# EAGLE design tiny-bridge (EAGLE 5.07)
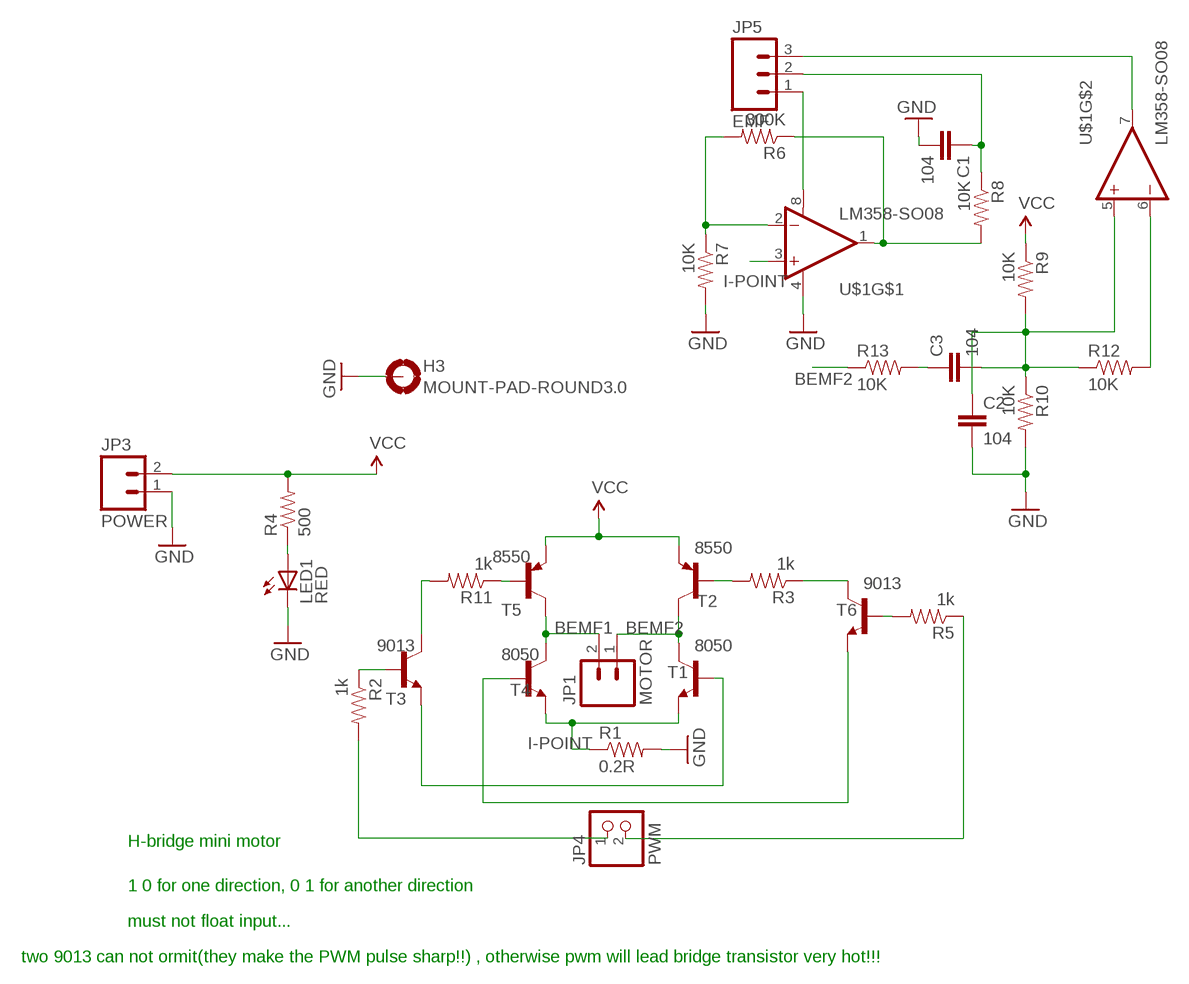
[diagram p0: schematic, sheet 1]

## Parts
C1  104  CAP-C0805  [C0805]
C2  104  CAP-C0805  [C0805]
C3  104  CAP-C0805  [C0805]
H3  MOUNT-PAD-ROUND3.0  [3,0-PAD]
JP1  MOTOR  CON-02-XH  [XH-1X2-LONG-LOCK]
JP3  POWER  CON-02-XH  [XH-1X2-LONG-LOCK]
JP4  PWM  PINHD-1X2/90  [1X02/90]
JP5  EMF  M03PTH  [1X03]
LED1  RED  LED0805  [CHIPLED_0805]
R1  0.2R  RESISTOR-R2512  [R2512]
R2  1k  RESISTOR0805  [0805]
R3  1k  RESISTOR0805  [0805]
R4  500  RESISTOR0805  [0805]
R5  1k  RESISTOR0805  [0805]
R6  300K  RESISTOR0805  [0805]
R7  10K  RESISTOR0805  [0805]
R8  10K  RESISTOR0805  [0805]
R9  10K  RESISTOR0805  [0805]
R10  10K  RESISTOR0805  [0805]
R11  1k  RESISTOR0805  [0805]
R12  10K  RESISTOR0805  [0805]
R13  10K  RESISTOR0805  [0805]
T1  8050  90**-NPN-SOT23-BEC  [SOT23-BEC]
T2  8550  90**-PNP-SOT23-BEC  [SOT23-BEC]
T3  9013  90**-NPN-SOT23-BEC  [SOT23-BEC]
T4  8050  90**-NPN-SOT23-BEC  [SOT23-BEC]
T5  8550  90**-PNP-SOT23-BEC  [SOT23-BEC]
T6  9013  90**-NPN-SOT23-BEC  [SOT23-BEC]
U$1  LM358-SO08  [SO08]

## Nets
BEMF1: JP1.2 T4.C T5.C
BEMF2: JP1.1 R13.1 T1.C T2.C
GND: C1.2 C2.2 H3.B3,0(MOUNT) JP3.1 LED1.C R1.2 R7.2 R10.2 U$1.4(V-)
I-POINT: R1.1 T1.E T4.E U$1.3(+IN)
N$1: LED1.A R4.1
N$2: R11.1 T5.B
N$3: JP5.1 U$1.8(V+)
N$5: T4.B T6.E
N$6: R3.2 T2.B
N$8: T1.B T3.E
N$9: R11.2 T3.C
N$10: JP4.2 R5.1
N$11: R5.2 T6.B
N$12: R3.1 T6.C
N$13: JP4.1 R2.2
N$14: R2.1 T3.B
N$15: C1.1 JP5.2 R8.1
N$16: R6.1 R8.2 U$1.1(OUT)
N$17: R6.2 R7.1 U$1.2(-IN)
N$19: C2.1 C3.2 R9.2 R10.1 R12.1 U$1.5(+IN)
N$20: R12.2 U$1.6(-IN)
N$22: JP5.3 U$1.7(OUT)
N$23: C3.1 R13.2
VCC: JP3.2 R4.2 R9.1 T2.E T5.E

## Notes on the sheet
- H-bridge mini motor
- 1 0 for one direction, 0 1 for another direction
- must not float input...
- two 9013 can not ormit(they make the PWM pulse sharp!!) , otherwise pwm will lead bridge transistor very hot!!!

## Library data of the parts
C1-C3 = digital-toy:CAP: Capacitor Standard 0603 ceramic capacitor, and 0.1" leaded capacitor.
H3 = holes:MOUNT-PAD-ROUND: MOUNTING PAD, round
JP1 JP3 = digital-toy:CON-02: Header 2 Standard 2-pin 0.1" header. Use with straight break away headers (SKU : PRT-00116), right angle break away headers (PRT-00553), swiss pins (PRT-00743), machine pins (PRT-00117), and female headers (PRT-00115). Molex polarized connector foot print use with SKU : PRT-08233 with associated crimp pins and housings.
JP4 = pinhead:PINHD-1X2: PIN HEADER
JP5 = SparkFun:M03: Header 3 Standard 3-pin 0.1" header. Use with straight break away headers (SKU : PRT-00116), right angle break away headers (PRT-00553), swiss pins (PRT-00743), machine pins (PRT-00117), and female headers (PRT-00115). Molex polarized connector foot print use with SKU : PRT-08232 with associated crimp pins and housings.
LED1 = digital-toy:LED: LEDs Standard schematic elements and footprints for 5mm, 3mm, 1206, and 0603 sized LEDs. 5mm - Spark Fun Electronics SKU : COM-00529 (and others) copy led.lbr 0805 led here, by hyl digital-toy. 2010.6.29
R1-R13 = digital-toy:RESISTOR: Resistor Basic schematic elements and footprints for 0603, 1206, and PTH 1/10th watt (small) resistors. digital-toy copy vertical mount of axial-0.3 from rcl.lbr : the 0207/xx
T1 T3 T4 T6 = digital-toy:*-NPN-: NPN Transistror most of sot-23 use the pacages sot23-BEC, top C, left B, right E. by hyl, digital-toy. and to-92 use ebc(from-top) by hyl, digital-toy.
T2 T5 = digital-toy:*-PNP-: PNP Transistror
U$1 = digital-toy:LM358

## Board
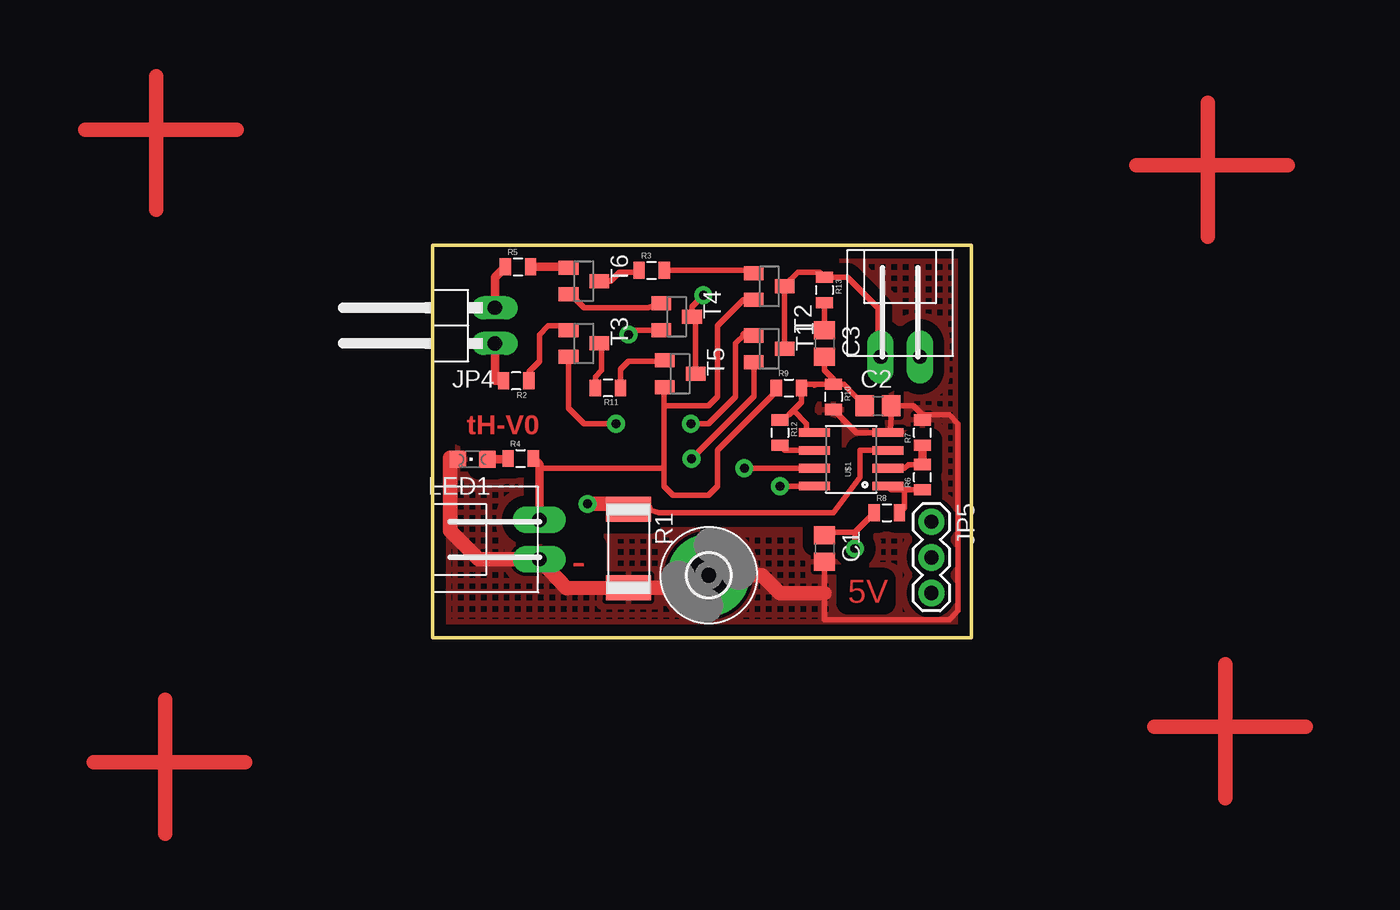
[diagram p1: board, top side]
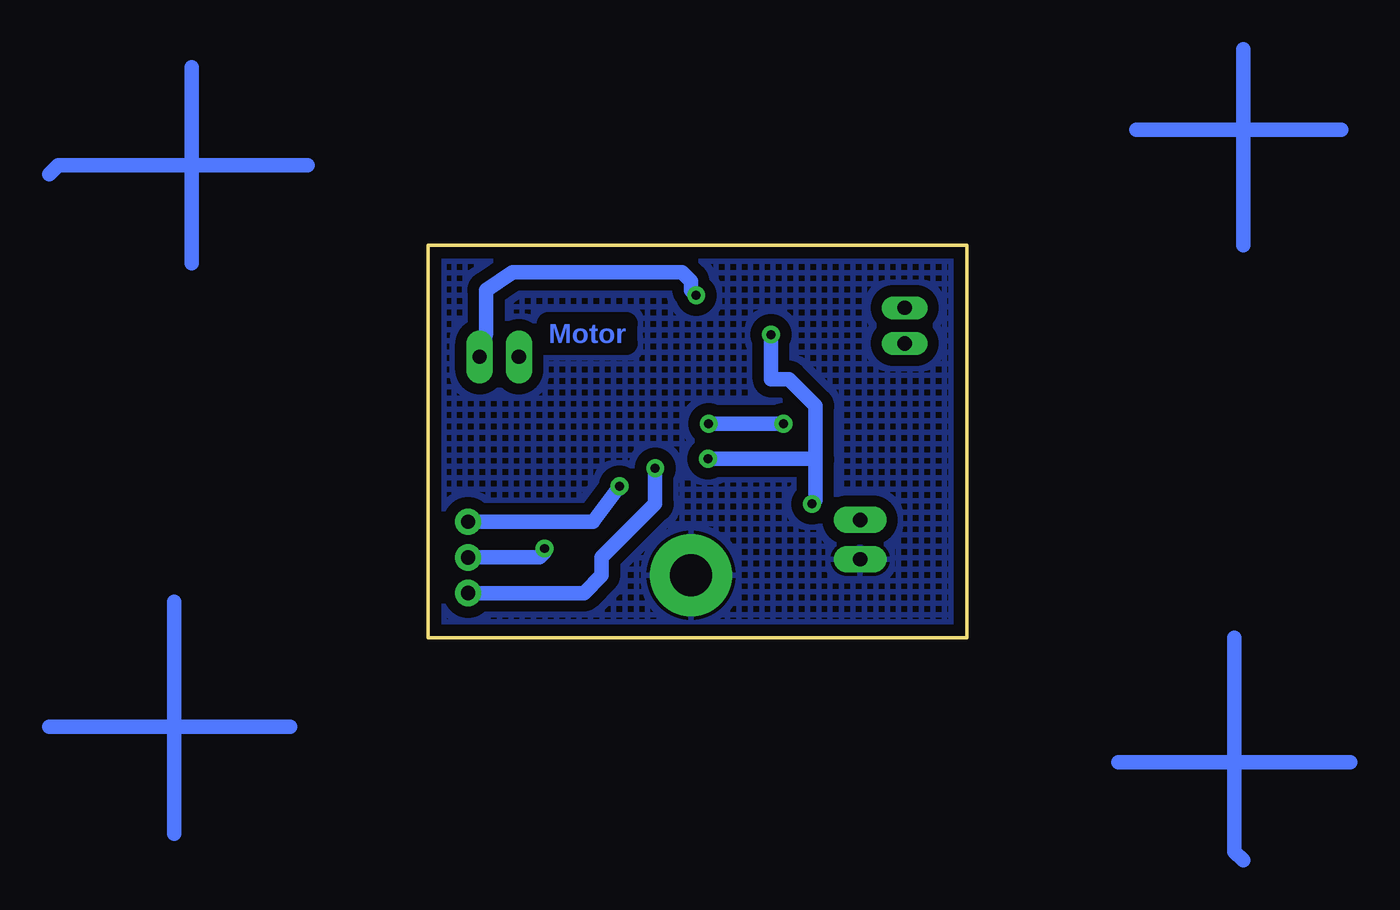
[diagram p2: board, bottom side, seen from below]

Size 38.42 x 27.94 mm. Coordinates in mm from the lower left corner, seen from the top.
Outline: 0,0 38.42,0 38.42,27.94 0,27.94 0,0
Copper layers (1*16): Top 0.035mm / dielectric 1.5mm / Bottom 0.035mm
Design rules "SparkFun-HP1007-600x600dpi": minimum track width 10mil, minimum drill 20mil, track to track 12mil, track to pad 12mil, pad to pad 12mil, via to via 12mil, smd to smd 12mil, copper to edge 12mil, drill to drill 12mil, minimum pad ring 12mil, minimum via ring 10mil, stop-mask expansion 4mil, vias tented up to drill 25mil, thermal gap 10mil

### Footprints (pad centres in the part's own frame; a part is rotated, then mirrored left to right if it is on the bottom)
C0805 = smd 1.3 x 1.5: 1 -0.95,0; 2 0.95,0
3,0-PAD = drill 3 pad 5.842 round: B3,0 0,0
XH-1X2-LONG-LOCK = drill 1.016 pad 1.88 long: 1 -1.397,0; 2 1.397,0
1X02/90 = drill 1.016 long: 1 -1.27,-3.81; 2 1.27,-3.81
1X03 = drill 1.016 pad 1.88 round: 1 0,0; 2 2.54,0; 3 5.08,0
CHIPLED_0805 = smd 1.2 x 1.2: A 0,-1.05; C 0,1.05
R2512 = smd 1.8 x 3.2: 1 -2.8,0; 2 2.8,0
0805 = smd 0.8 x 1.2: 1 -0.9,0; 2 0.9,0
SOT23-BEC = smd 1 x 1.4: B -0.95,-1.1; C 0,1.1; E 0.95,-1.1
SO08 = smd 0.61 x 2.21: 1 -1.905,-2.616; 2 -0.635,-2.616; 3 0.635,-2.616; 4 1.905,-2.616; 5 1.905,2.616; 6 0.635,2.616; 7 -0.635,2.616; 8 -1.905,2.616

### Placement (x,y rotation side)
C1  27.94,6.35 270 top
C2  31.75,16.51 0 top
C3  27.94,20.95 270 top
H3  19.68,4.45 0 top
JP1  33.34,20 0 top
JP3  7.62,6.99 90 top
JP4  0.64,22.23 90 top
JP5  35.56,8.26 270 top
LED1  2.86,12.7 90 top
R1  13.97,6.35 270 top
R2  5.97,18.29 180 top
R3  15.62,26.16 0 top
R4  6.29,12.76 0 top
R5  6.1,26.42 0 top
R6  34.92,11.43 90 top
R7  34.92,14.61 90 top
R8  32.38,8.89 0 top
R9  25.4,17.78 0 top
R10  28.57,17.14 270 top
R11  12.51,17.78 180 top
R12  24.77,14.61 270 top
R13  27.94,24.77 270 top
T1  24,20.57 270 top
T2  24,25.02 270 top
T3  10.79,20.95 270 top
T4  17.4,22.86 270 top
T5  17.65,18.8 270 top
T6  10.79,25.4 270 top
U$1  29.84,12.7 90 top

### Tracks (layer width: path | path; a pad name or v marks a point on that pad's centre or on a via)
BEMF1  (via drill 0.64 pad 1.27)
  Top 0.406: T5.C 18.75,22.56 | T4.C 18.5,23.58 v19.3,24.38
  Top 0.61: 18.75,22.56 18.41,22.86 T4.C
  Bottom 0.254: 19.68,25.27 19.68,25.4
  Bottom 1.016: JP1.2 34.29,21.72 34.29,24.77 32.38,26.04 20.32,26.04 19.68,25.4 | 19.68,25.27 19.68,24.77 v19.3,24.38
BEMF2
  Top 0.406: T1.C T2.C 25.1,25.1 26.04,26.04 27.57,26.04 R13.1 29.58,25.66 31.75,23.5 31.75,20.19 JP1.1
GND
  Top 0.406: C1.2 27.94,3.17 27.94,1.27 36.83,1.27 37.47,1.91 37.47,15.24 36.83,15.88 34.92,15.88 | 34.92,15.88 34.29,16.51 C2.2 32.65,14.61 U$1.4 | U$1.4 33.02,14.61 | U$1.4 30.21,14.61 R10.2 | JP3.1 7.79,5.42 | 34.92,15.88 R7.2
  Top 0.61: 1.27,12.8 LED1.C
  Top 1.016: 1.27,12.8 1.27,7.62 3.3,5.59 JP3.1 | 27.94,3.17 24.77,3.17 23.5,4.45 H3.B3,0 18.79,3.55 R1.2 9.56,3.52 7.79,5.42
  pour Bottom (isolate 0.813, rank 6, hatched): -8.57,34.61 46.67,34.29 46.99,-14.29 -9.21,-10.79
  pour Top (isolate 0.813, hatched): -3.81,31.43 44.45,30.8 43.81,-3.49 43.81,-9.84 -3.17,-9.84 -4.13,-9.53 -4.13,-0.64
I-POINT  (via drill 0.64 pad 1.27)
  Top 0.406: T4.E 14.29,21.91 v13.97,21.59 | T1.E 22.9,17.19 v18.46,12.74 | U$1.3 30.48,13.34 30.48,11.43 28.57,8.89 16.13,8.89 15.2,9.19 | 13.68,9.53 R1.1
  Top 1.016: v11.05,9.53 13.68,9.53 | R1.1 15.2,9.19
  Bottom 0.406: 10.79,12.7 10.84,12.74
  Bottom 1.016: v13.97,21.59 13.97,18.41 12.7,18.41 10.79,16.51 10.79,12.7 10.79,9.78 v11.05,9.53 | 10.84,12.74 v18.46,12.74
N$1
  Top 0.254: 5.32,12.7 R4.1
  Top 0.61: LED1.A 5.32,12.7
N$2
  Top 0.254: 16.49,19.68 T5.B
  Top 0.406: R11.1 13.41,19.12 13.97,19.68 16.49,19.68
N$3  (via drill 0.64 pad 1.27)
  Top 0.406: v24.77,10.79 U$1.8
  Bottom 1.016: JP5.1 26.67,8.26 v24.77,10.79
N$5
  Top 0.254: T6.E 9.84,24.45
  Top 0.406: 9.84,24.45 10.79,23.5 15.35,23.5 T4.B
N$6
  Top 0.254: 22.71,26.16 T2.B
  Top 0.406: R3.2 22.71,26.16
N$7
  Top 1.016: -24.77,36.2 -13.97,36.2
N$8  (via drill 0.64 pad 1.27)
  Top 0.254: 22.84,21.59 T1.B
  Top 0.406: 22.23,21.59 21.59,20.95 21.59,17.14 19.68,15.24 v18.41,15.24 | T3.E 9.7,16.34 10.79,15.24 v13.08,15.24
  Top 0.61: 22.23,21.59 22.84,21.59
  Bottom 1.016: v13.08,15.24 v18.41,15.24
N$9
  Top 0.254: 12.06,20.79 T3.C
  Top 0.406: R11.2 11.61,18.59 12.06,19.05 12.06,20.79
N$10
  Top 0.61: JP4.2 4.45,25.66 R5.1
N$11
  Top 0.254: 9.06,26.42 T6.B
  Top 0.61: R5.2 9.06,26.42
N$12
  Top 0.254: 14.59,26.04 R3.1
  Top 0.406: T6.C 12.7,25.4 13.34,26.04 14.59,26.04
N$13
  Top 0.61: JP4.1 4.45,18.3 R2.2
N$14
  Top 0.406: R2.1 6.87,18.93 7.62,19.68 7.62,21.59 8.26,22.23 9.38,22.23 T3.B
N$15  (via drill 0.64 pad 1.27)
  Top 0.406: 30.11,7.51 R8.1 | 30.11,7.51 v30.11,6.35 | C1.1 28.2,7.51 30.11,7.51
  Bottom 1.016: JP5.2 30.48,5.71 30.11,6.08 v30.11,6.35
N$16
  Top 0.406: 35.19,10.53 R6.1 33.66,10.53 | U$1.1 32.73,10.53 33.66,10.53 | R8.2 33.66,9.26 33.66,10.53
N$17
  Top 0.406: U$1.2 33.66,12.06 33.92,12.33 R6.2
  Top 0.61: R6.2 R7.1
N$18
  Top 1.016: -19.68,30.48 -19.68,40.01
N$19
  Top 0.406: R10.1 29.32,18.05 C2.1 | C3.2 27.94,19.05 28.57,18.41 R10.1 | 27.3,18.05 26.57,18.05 R9.2 26.3,16.77 25.72,16.19 | 27.3,18.05 R10.1 | 25.72,16.19 25.4,15.88 R12.1 | 27.3,18.05 27.23,17.97 | U$1.5 26.67,14.61 26.67,15.24 25.72,16.19
N$20
  Top 0.406: U$1.6 25.14,13.34 R12.2
N$21
  Top 1.016: 50.16,33.66 60.96,33.66
N$22  (via drill 0.64 pad 1.27)
  Top 0.406: v22.23,12.06 U$1.7
  Bottom 1.016: JP5.3 27.94,3.17 27.3,3.17 26.04,4.45 26.04,5.71 22.23,9.53 v22.23,12.06
N$23
  Top 0.406: C3.1 R13.2
N$24
  Top 1.016: 55.24,28.57 55.24,38.1
N$25
  Top 1.016: 51.44,-6.35 62.23,-6.35
N$26
  Top 1.016: 56.52,-11.43 56.52,-1.91
N$27
  Top 1.016: -13.34,-8.89 -24.13,-8.89
N$28
  Top 1.016: -19.05,-4.45 -19.05,-13.97
N$29
  Bottom 1.016: -26.67,36.2 -12.06,36.2
N$30
  Bottom 1.016: -19.68,27.94 -19.68,41.91
N$31
  Bottom 1.016: 46.99,33.66 64.77,33.66 65.41,33.02
N$32
  Bottom 1.016: 55.24,26.67 55.24,40.64
N$33
  Bottom 1.016: 48.26,-6.35 65.41,-6.35
N$34
  Bottom 1.016: 56.52,-13.97 56.52,2.54
N$35
  Bottom 1.016: -10.79,-8.89 -27.3,-8.89
N$36
  Bottom 1.016: -19.05,0 -19.05,-15.24 -19.68,-15.88
VCC
  Top 0.254: JP3.2 7.75,12.06 | 16.51,17.8 T5.E
  Top 0.406: 16.51,16.51 16.51,17.8 | T2.E 22.16,24.07 20.32,22.23 20.32,17.14 19.68,16.51 16.51,16.51 | 16.51,12.06 16.51,10.79 17.14,10.16 19.68,10.16 20.32,10.79 20.32,13.34 24.5,17.52 R9.1 | 16.51,12.06 16.51,16.51 | 7.75,12.06 16.51,12.06
  Top 0.61: JP3.2 7.62,12.33 R4.2

### Text on the board
Top: tH-V0 | - | 5V
Bottom: Motor